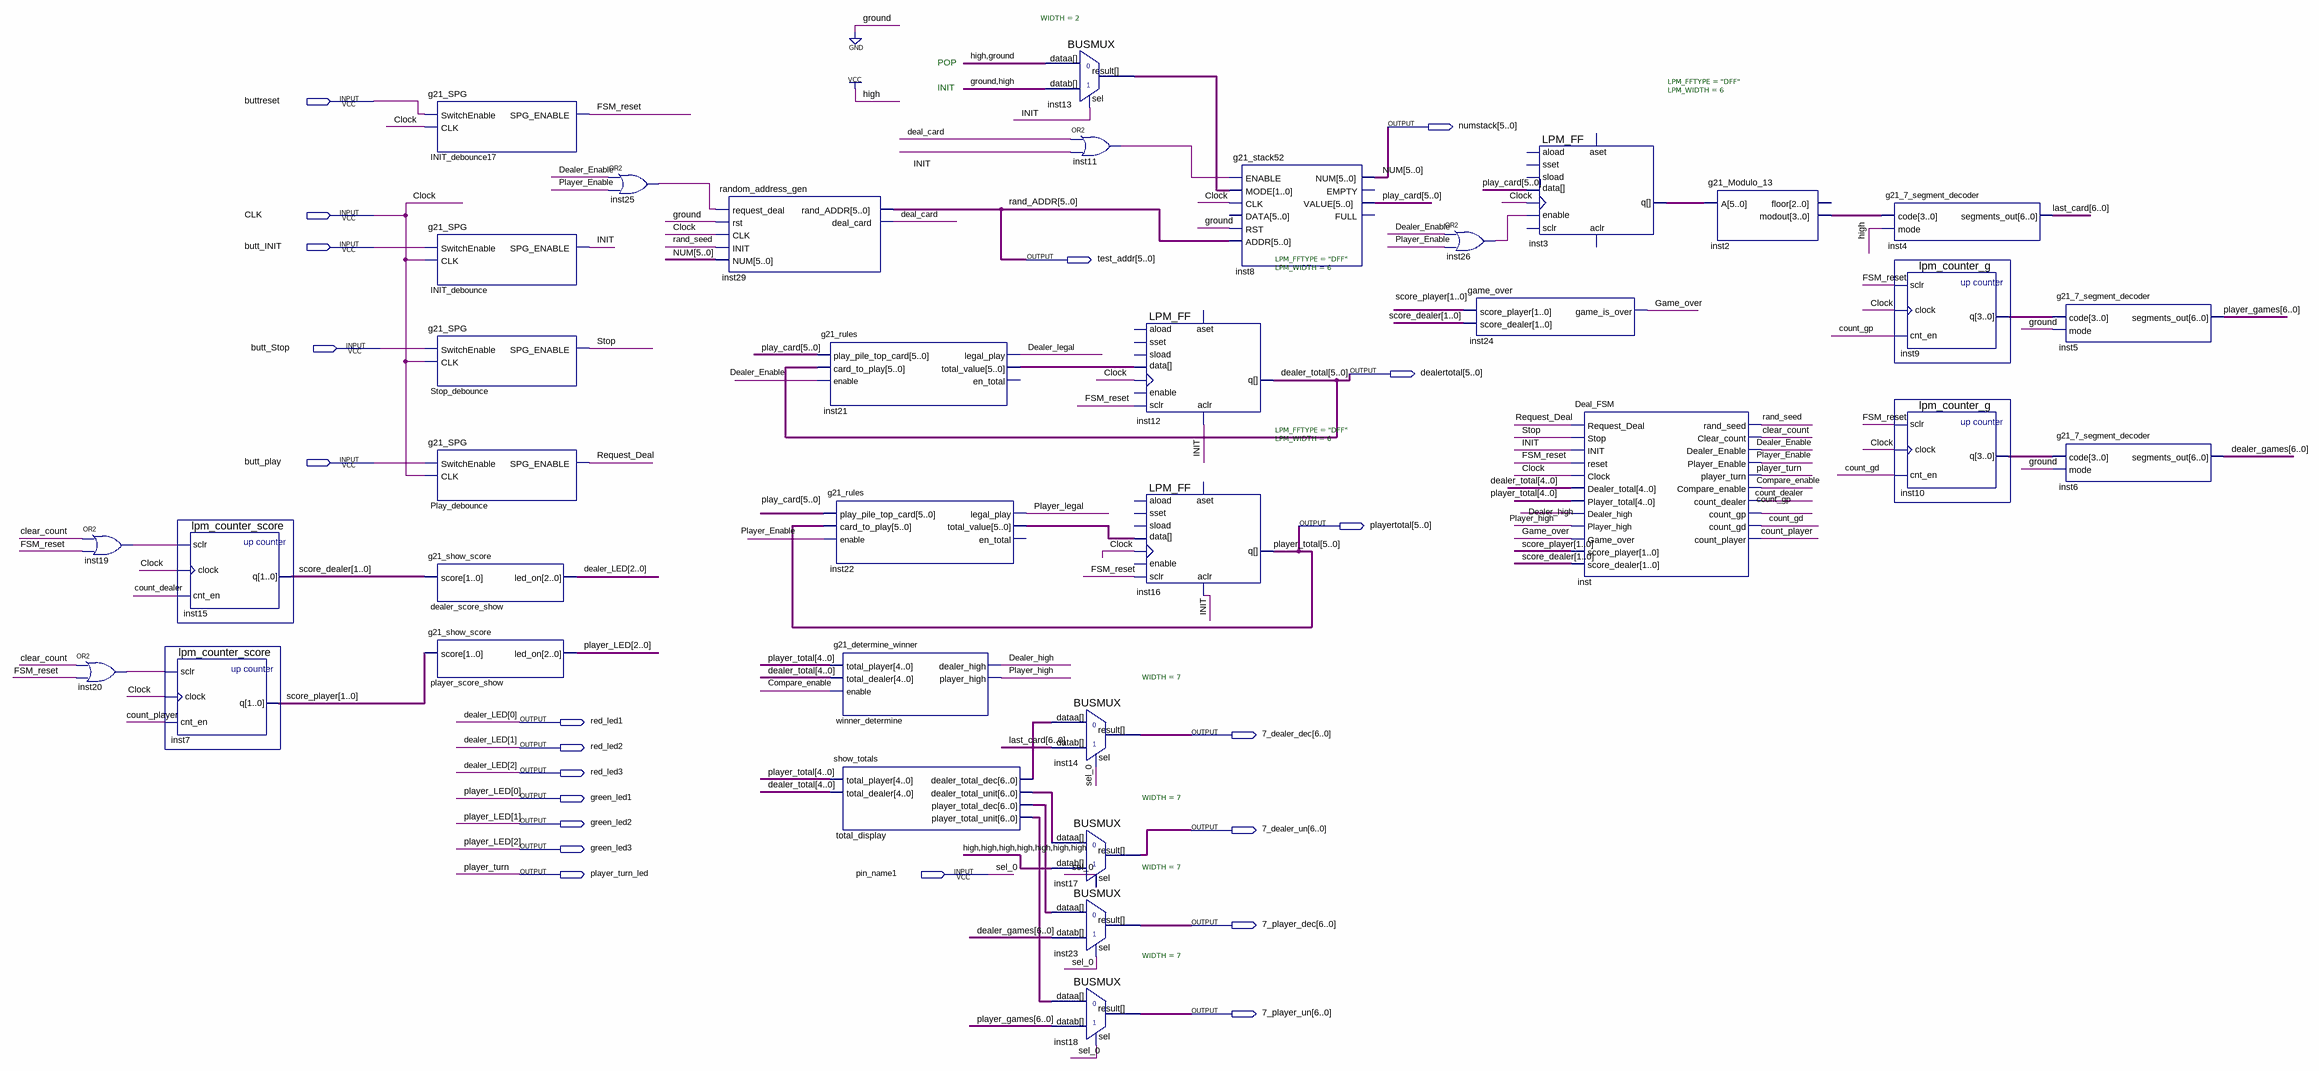
[diagram p0: schematic sheet]
// Quartus schematic g21_lab5_testbed.bdf as structural Verilog: 35 symbols, 21 pins
module g21_lab5_testbed (
  input  buttreset,
  input  CLK,
  input  butt_INIT,
  input  butt_Stop,
  input  butt_play,
  input  pin_name1,
  output [5:0] numstack,
  output [5:0] test_addr,
  output [5:0] dealertotal,
  output [5:0] playertotal,
  output red_led1,
  output [6:0] \7_dealer_dec ,
  output red_led2,
  output red_led3,
  output green_led1,
  output green_led2,
  output [6:0] \7_dealer_un ,
  output green_led3,
  output player_turn_led,
  output [6:0] \7_player_dec ,
  output [6:0] \7_player_un 
);

  wire clear_count, Compare_enable, count_dealer, count_gd, count_gp, count_player, deal_card, Dealer_Enable,
       Dealer_high, Dealer_legal, FSM_reset, Game_over, INIT, inst11_out, inst19_out, inst20_out, inst25_out,
       inst26_out, Player_Enable, Player_high, Player_legal, rand_seed, Request_Deal, Stop;
  wire [1:0] inst13_result, score_dealer, score_player;
  wire [3:0] inst2_modout, inst9_q, inst10_q;
  wire [5:0] inst3_q, inst21_total_value, inst22_total_value, play_card;
  wire [6:0] dealer_games, last_card, player_games, total_display_dealer_total_dec,
       total_display_dealer_total_unit, total_display_player_total_dec, total_display_player_total_unit;

  or inst19 (inst19_out, clear_count, FSM_reset);
  or inst20 (inst20_out, clear_count, FSM_reset);
  lpm_counter_score inst7 (.sclr(inst20_out), .clock(CLK), .cnt_en(count_player), .q(score_player));
  lpm_counter_score inst15 (.sclr(inst19_out), .clock(CLK), .cnt_en(count_dealer), .q(score_dealer));
  g21_SPG INIT_debounce17 (.SwitchEnable(buttreset), .CLK(CLK), .SPG_ENABLE(FSM_reset));
  g21_SPG INIT_debounce (.SwitchEnable(butt_INIT), .CLK(CLK), .SPG_ENABLE(INIT));
  g21_SPG Stop_debounce (.SwitchEnable(butt_Stop), .CLK(CLK), .SPG_ENABLE(Stop));
  g21_SPG Play_debounce (.SwitchEnable(butt_play), .CLK(CLK), .SPG_ENABLE(Request_Deal));
  g21_show_score dealer_score_show (.score(score_dealer), .led_on({red_led3, red_led2, red_led1}));
  g21_show_score player_score_show (.score(score_player), .led_on({green_led3, green_led2, green_led1}));
  or inst25 (inst25_out, Dealer_Enable, Player_Enable);
  random_address_gen inst29 (
    .request_deal(inst25_out), .rst(1'b0), .CLK(CLK), .INIT(rand_seed), .NUM(numstack),
    .rand_ADDR(test_addr), .deal_card(deal_card));
  g21_rules inst21 (
    .play_pile_top_card(play_card), .card_to_play(dealertotal), .enable(Dealer_Enable),
    .legal_play(Dealer_legal), .total_value(inst21_total_value));  // open: en_total
  g21_rules inst22 (
    .play_pile_top_card(play_card), .card_to_play(playertotal), .enable(Player_Enable),
    .legal_play(Player_legal), .total_value(inst22_total_value));  // open: en_total
  g21_determine_winner winner_determine (
    .total_player(playertotal[4:0]), .total_dealer(dealertotal[4:0]), .enable(Compare_enable),
    .dealer_high(Dealer_high), .player_high(Player_high));
  show_totals total_display (
    .total_player(playertotal[4:0]), .total_dealer(dealertotal[4:0]),
    .dealer_total_dec(total_display_dealer_total_dec), .dealer_total_unit(total_display_dealer_total_unit),
    .player_total_dec(total_display_player_total_dec), .player_total_unit(total_display_player_total_unit));
  BUSMUX #(.WIDTH(2)) inst13 (.datab(2'b01), .sel(INIT), .dataa(2'b10), .result(inst13_result));
  or inst11 (inst11_out, deal_card, INIT);
  BUSMUX #(.WIDTH(7)) inst14 (
    .datab(last_card), .sel(pin_name1), .dataa(total_display_dealer_total_dec), .result(\7_dealer_dec ));
  BUSMUX #(.WIDTH(7)) inst17 (
    .datab({7{1'b1}}), .sel(pin_name1), .dataa(total_display_dealer_total_unit), .result(\7_dealer_un ));
  BUSMUX #(.WIDTH(7)) inst23 (
    .datab(dealer_games), .sel(pin_name1), .dataa(total_display_player_total_dec), .result(\7_player_dec ));
  BUSMUX #(.WIDTH(7)) inst18 (
    .datab(player_games), .sel(pin_name1), .dataa(total_display_player_total_unit), .result(\7_player_un ));
  LPM_FF #(.LPM_FFTYPE("DFF"), .LPM_WIDTH(6)) inst12 (
    .clock(CLK), .sclr(FSM_reset), .aclr(INIT), .data(inst21_total_value), .q(dealertotal));  // open: enable, aload, sset, sload, aset
  LPM_FF #(.LPM_FFTYPE("DFF"), .LPM_WIDTH(6)) inst16 (
    .clock(CLK), .sclr(FSM_reset), .aclr(INIT), .data(inst22_total_value), .q(playertotal));  // open: enable, aload, sset, sload, aset
  g21_stack52 inst8 (
    .ENABLE(inst11_out), .MODE(inst13_result), .CLK(CLK), .RST(1'b0), .ADDR(test_addr), .NUM(numstack),
    .VALUE(play_card));  // open: DATA, EMPTY, FULL
  or inst26 (inst26_out, Dealer_Enable, Player_Enable);
  game_over inst24 (.score_player(score_player), .score_dealer(score_dealer), .game_is_over(Game_over));
  LPM_FF #(.LPM_FFTYPE("DFF"), .LPM_WIDTH(6)) inst3 (
    .enable(inst26_out), .clock(CLK), .data(play_card), .q(inst3_q));  // open: aload, sset, sload, aset, sclr, aclr
  Deal_FSM inst (
    .Request_Deal(Request_Deal), .Stop(Stop), .INIT(INIT), .reset(FSM_reset), .Clock(CLK),
    .Dealer_total(dealertotal[4:0]), .Player_total(playertotal[4:0]), .Dealer_high(Dealer_high),
    .Player_high(Player_high), .Game_over(Game_over), .score_player(score_player),
    .score_dealer(score_dealer), .rand_seed(rand_seed), .Clear_count(clear_count),
    .Dealer_Enable(Dealer_Enable), .Player_Enable(Player_Enable), .player_turn(player_turn_led),
    .Compare_enable(Compare_enable), .count_dealer(count_dealer), .count_gp(count_gp), .count_gd(count_gd),
    .count_player(count_player));
  g21_Modulo_13 inst2 (.A(inst3_q), .modout(inst2_modout));  // open: floor
  g21_7_segment_decoder inst4 (.code(inst2_modout), .mode(1'b1), .segments_out(last_card));
  lpm_counter_g inst9 (.sclr(FSM_reset), .clock(CLK), .cnt_en(count_gp), .q(inst9_q));
  lpm_counter_g inst10 (.sclr(FSM_reset), .clock(CLK), .cnt_en(count_gd), .q(inst10_q));
  g21_7_segment_decoder inst5 (.code(inst9_q), .mode(1'b0), .segments_out(player_games));
  g21_7_segment_decoder inst6 (.code(inst10_q), .mode(1'b0), .segments_out(dealer_games));

  // Other names for the same wires on the sheet: Clock = CLK; dealer_LED[2:0] = {red_led3, red_led2, red_led1};
  //   dealer_total[5:0] = dealertotal; NUM[5:0] = numstack; player_LED[2:0] = {green_led3, green_led2, green_led1};
  //   player_turn = player_turn_led; player_total[5:0] = playertotal; sel_0 = pin_name1; rand_ADDR[5:0] = test_addr

  // Notes on the sheet:
  //   POP
  //   INIT
endmodule
